# EAGLE design dmx2rgb (EAGLE 6.2)
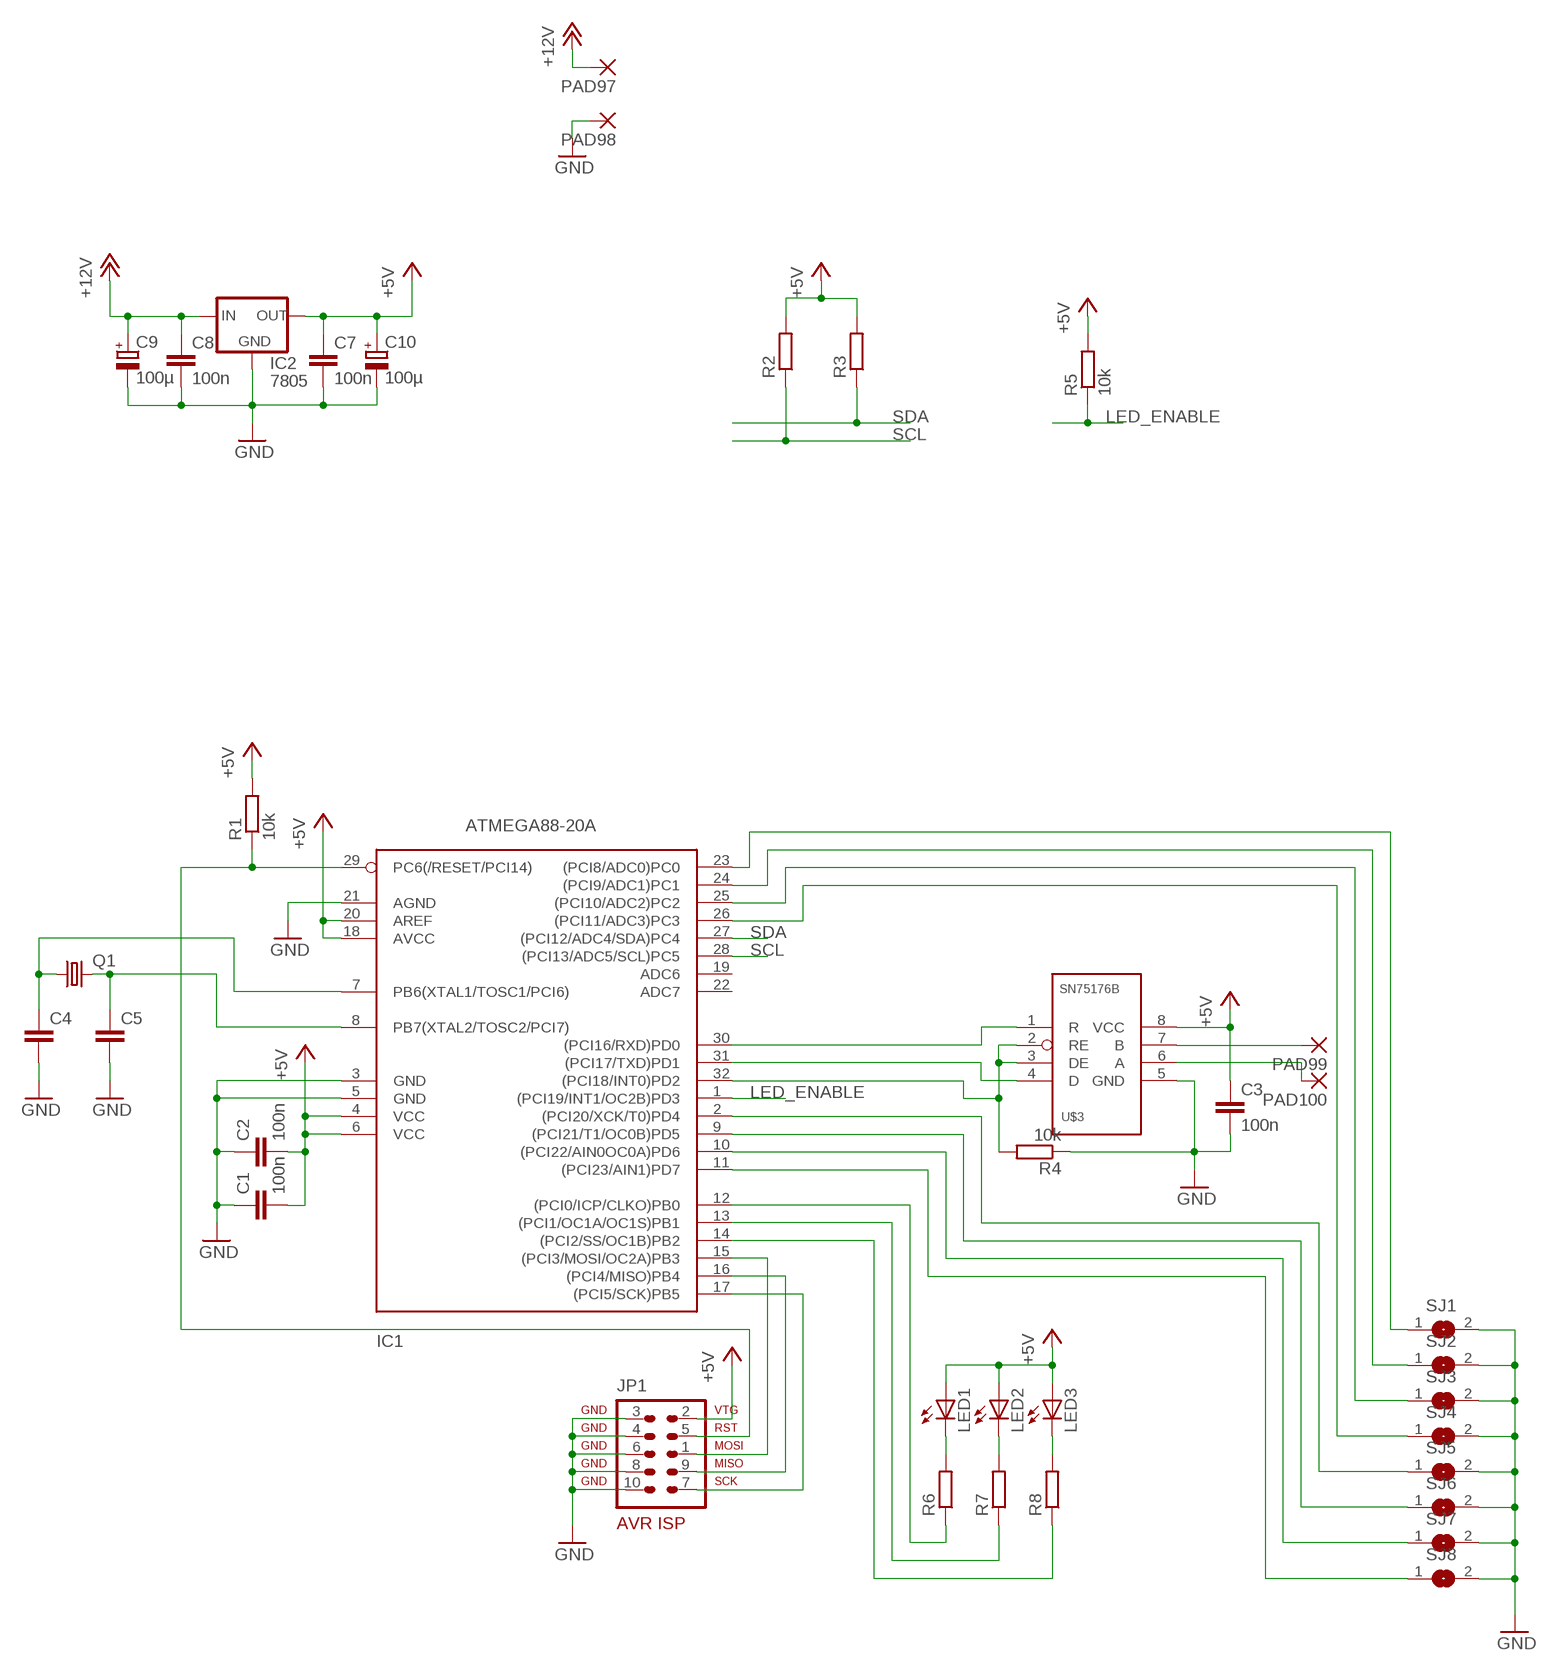
[diagram p0: schematic, sheet 1, part 1 of 2]
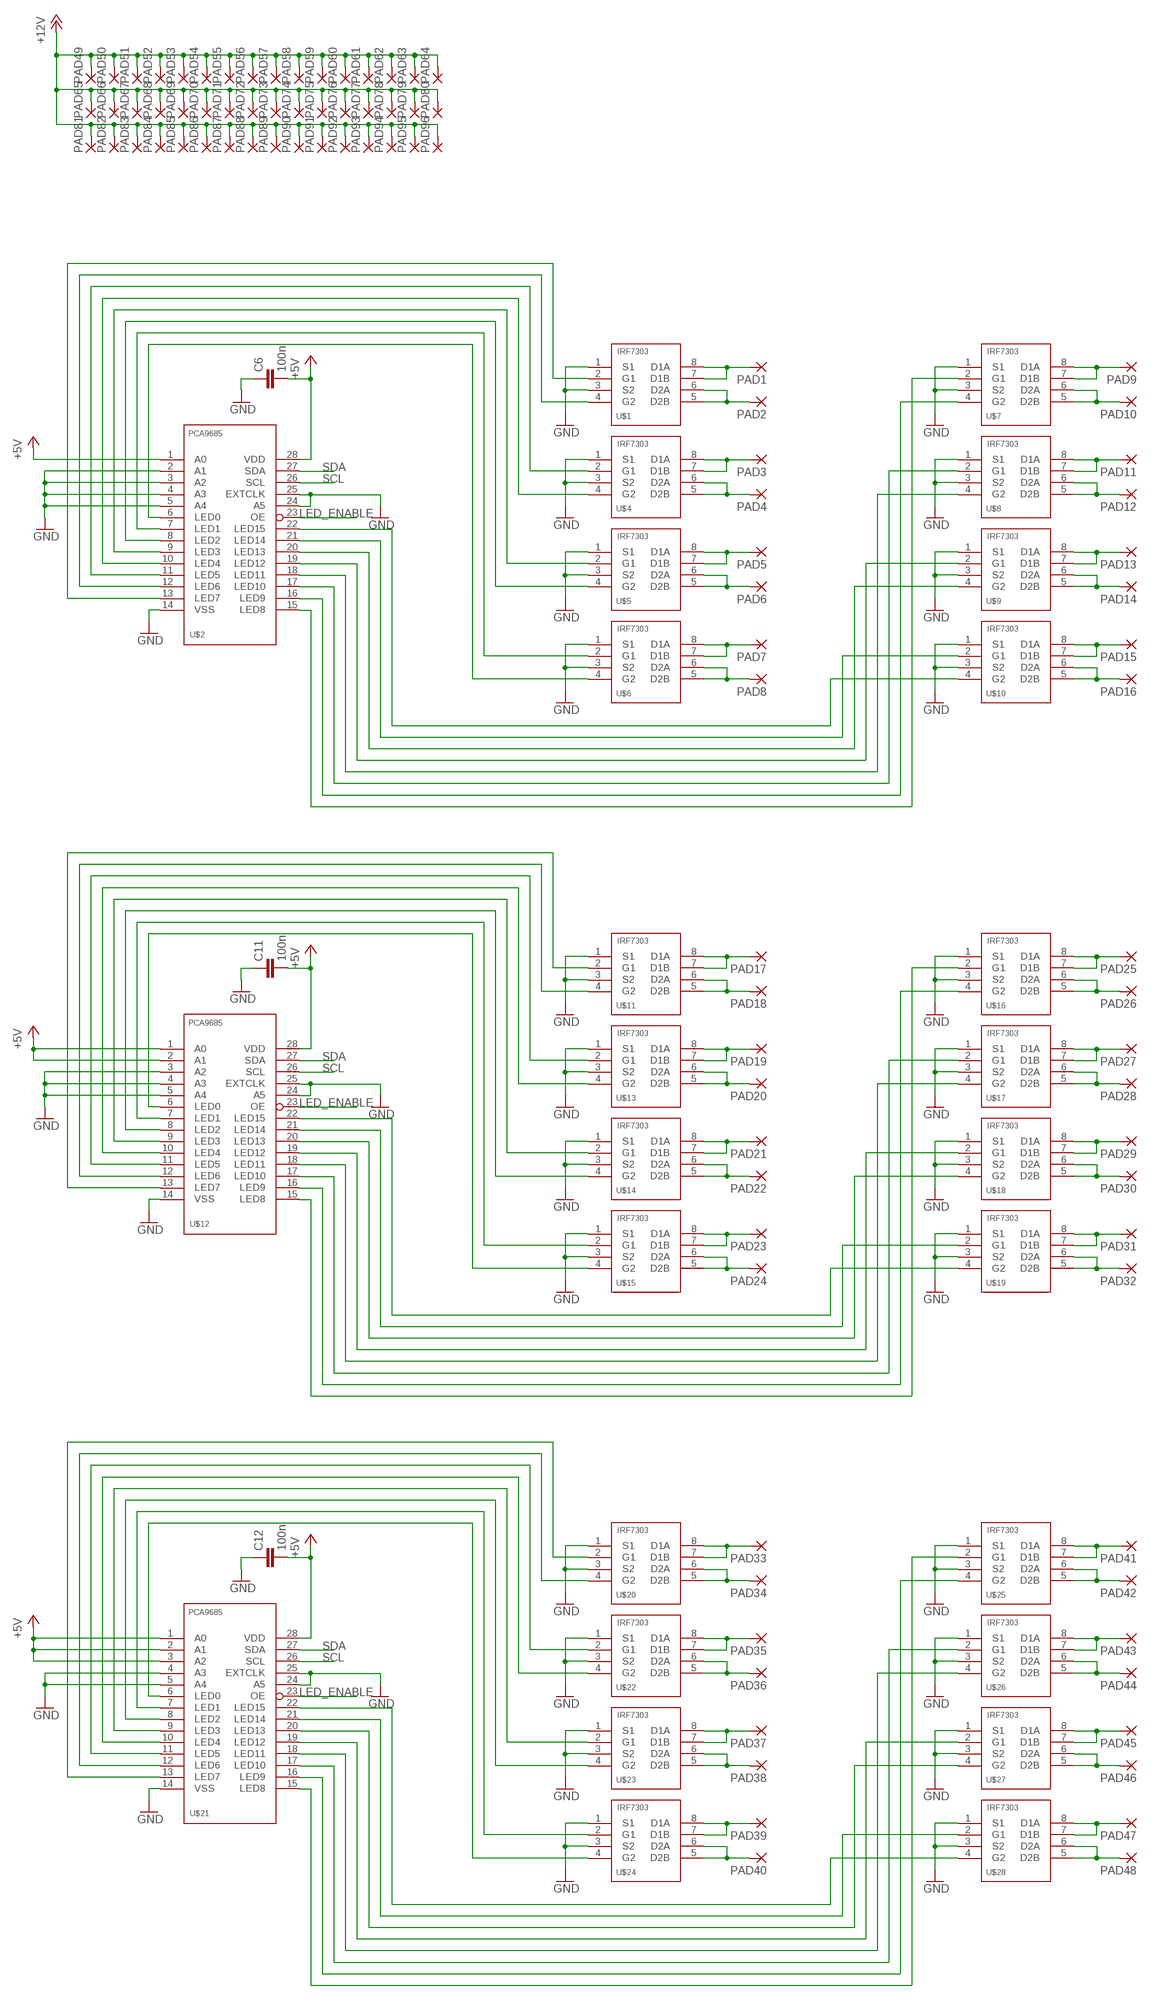
[diagram p1: schematic, sheet 1, part 2 of 2]

## Parts
C1  100n  C0805  [CHIP_0805]
C2  100n  C0805  [CHIP_0805]
C3  100n  C0805  [CHIP_0805]
C4  C0805  [CHIP_0805]
C5  C0805  [CHIP_0805]
C6  100n  C0805  [CHIP_0805]
C7  100n  C0805  [CHIP_0805]
C8  100n  C0805  [CHIP_0805]
C9  100µ  CPOL-EUE2.5-7  [E2,5-7]
C10  100µ  CPOL-EUE2.5-7  [E2,5-7]
C11  100n  C0805  [CHIP_0805]
C12  100n  C0805  [CHIP_0805]
IC1  ATMEGA88-20A  [TQFP32-08]
IC2  7805  78LXX  [78LXX]
JP1  AVR-ISP-10  [AVR-ISP-10]
LED1  LEDCHIPLED_0805  [CHIPLED_0805]
LED2  LEDCHIPLED_0805  [CHIPLED_0805]
LED3  LEDCHIPLED_0805  [CHIPLED_0805]
PAD1  SMD_PAD_LONG  [SMD_PAD_LONG]
PAD2  SMD_PAD_LONG  [SMD_PAD_LONG]
PAD3  SMD_PAD_LONG  [SMD_PAD_LONG]
PAD4  SMD_PAD_LONG  [SMD_PAD_LONG]
PAD5  SMD_PAD_LONG  [SMD_PAD_LONG]
PAD6  SMD_PAD_LONG  [SMD_PAD_LONG]
PAD7  SMD_PAD_LONG  [SMD_PAD_LONG]
PAD8  SMD_PAD_LONG  [SMD_PAD_LONG]
PAD9  SMD_PAD_LONG  [SMD_PAD_LONG]
PAD10  SMD_PAD_LONG  [SMD_PAD_LONG]
PAD11  SMD_PAD_LONG  [SMD_PAD_LONG]
PAD12  SMD_PAD_LONG  [SMD_PAD_LONG]
PAD13  SMD_PAD_LONG  [SMD_PAD_LONG]
PAD14  SMD_PAD_LONG  [SMD_PAD_LONG]
PAD15  SMD_PAD_LONG  [SMD_PAD_LONG]
PAD16  SMD_PAD_LONG  [SMD_PAD_LONG]
PAD17  SMD_PAD_LONG  [SMD_PAD_LONG]
PAD18  SMD_PAD_LONG  [SMD_PAD_LONG]
PAD19  SMD_PAD_LONG  [SMD_PAD_LONG]
PAD20  SMD_PAD_LONG  [SMD_PAD_LONG]
PAD21  SMD_PAD_LONG  [SMD_PAD_LONG]
PAD22  SMD_PAD_LONG  [SMD_PAD_LONG]
PAD23  SMD_PAD_LONG  [SMD_PAD_LONG]
PAD24  SMD_PAD_LONG  [SMD_PAD_LONG]
PAD25  SMD_PAD_LONG  [SMD_PAD_LONG]
PAD26  SMD_PAD_LONG  [SMD_PAD_LONG]
PAD27  SMD_PAD_LONG  [SMD_PAD_LONG]
PAD28  SMD_PAD_LONG  [SMD_PAD_LONG]
PAD29  SMD_PAD_LONG  [SMD_PAD_LONG]
PAD30  SMD_PAD_LONG  [SMD_PAD_LONG]
PAD31  SMD_PAD_LONG  [SMD_PAD_LONG]
PAD32  SMD_PAD_LONG  [SMD_PAD_LONG]
PAD33  SMD_PAD_LONG  [SMD_PAD_LONG]
PAD34  SMD_PAD_LONG  [SMD_PAD_LONG]
PAD35  SMD_PAD_LONG  [SMD_PAD_LONG]
PAD36  SMD_PAD_LONG  [SMD_PAD_LONG]
PAD37  SMD_PAD_LONG  [SMD_PAD_LONG]
PAD38  SMD_PAD_LONG  [SMD_PAD_LONG]
PAD39  SMD_PAD_LONG  [SMD_PAD_LONG]
PAD40  SMD_PAD_LONG  [SMD_PAD_LONG]
PAD41  SMD_PAD_LONG  [SMD_PAD_LONG]
PAD42  SMD_PAD_LONG  [SMD_PAD_LONG]
PAD43  SMD_PAD_LONG  [SMD_PAD_LONG]
PAD44  SMD_PAD_LONG  [SMD_PAD_LONG]
PAD45  SMD_PAD_LONG  [SMD_PAD_LONG]
PAD46  SMD_PAD_LONG  [SMD_PAD_LONG]
PAD47  SMD_PAD_LONG  [SMD_PAD_LONG]
PAD48  SMD_PAD_LONG  [SMD_PAD_LONG]
PAD49  SMD_PAD_LONG  [SMD_PAD_LONG]
PAD50  SMD_PAD_LONG  [SMD_PAD_LONG]
PAD51  SMD_PAD_LONG  [SMD_PAD_LONG]
PAD52  SMD_PAD_LONG  [SMD_PAD_LONG]
PAD53  SMD_PAD_LONG  [SMD_PAD_LONG]
PAD54  SMD_PAD_LONG  [SMD_PAD_LONG]
PAD55  SMD_PAD_LONG  [SMD_PAD_LONG]
PAD56  SMD_PAD_LONG  [SMD_PAD_LONG]
PAD57  SMD_PAD_LONG  [SMD_PAD_LONG]
PAD58  SMD_PAD_LONG  [SMD_PAD_LONG]
PAD59  SMD_PAD_LONG  [SMD_PAD_LONG]
PAD60  SMD_PAD_LONG  [SMD_PAD_LONG]
PAD61  SMD_PAD_LONG  [SMD_PAD_LONG]
PAD62  SMD_PAD_LONG  [SMD_PAD_LONG]
PAD63  SMD_PAD_LONG  [SMD_PAD_LONG]
PAD64  SMD_PAD_LONG  [SMD_PAD_LONG]
PAD65  SMD_PAD_LONG  [SMD_PAD_LONG]
PAD66  SMD_PAD_LONG  [SMD_PAD_LONG]
PAD67  SMD_PAD_LONG  [SMD_PAD_LONG]
PAD68  SMD_PAD_LONG  [SMD_PAD_LONG]
PAD69  SMD_PAD_LONG  [SMD_PAD_LONG]
PAD70  SMD_PAD_LONG  [SMD_PAD_LONG]
PAD71  SMD_PAD_LONG  [SMD_PAD_LONG]
PAD72  SMD_PAD_LONG  [SMD_PAD_LONG]
PAD73  SMD_PAD_LONG  [SMD_PAD_LONG]
PAD74  SMD_PAD_LONG  [SMD_PAD_LONG]
PAD75  SMD_PAD_LONG  [SMD_PAD_LONG]
PAD76  SMD_PAD_LONG  [SMD_PAD_LONG]
PAD77  SMD_PAD_LONG  [SMD_PAD_LONG]
PAD78  SMD_PAD_LONG  [SMD_PAD_LONG]
PAD79  SMD_PAD_LONG  [SMD_PAD_LONG]
PAD80  SMD_PAD_LONG  [SMD_PAD_LONG]
PAD81  SMD_PAD_LONG  [SMD_PAD_LONG]
PAD82  SMD_PAD_LONG  [SMD_PAD_LONG]
PAD83  SMD_PAD_LONG  [SMD_PAD_LONG]
PAD84  SMD_PAD_LONG  [SMD_PAD_LONG]
PAD85  SMD_PAD_LONG  [SMD_PAD_LONG]
PAD86  SMD_PAD_LONG  [SMD_PAD_LONG]
PAD87  SMD_PAD_LONG  [SMD_PAD_LONG]
PAD88  SMD_PAD_LONG  [SMD_PAD_LONG]
PAD89  SMD_PAD_LONG  [SMD_PAD_LONG]
PAD90  SMD_PAD_LONG  [SMD_PAD_LONG]
PAD91  SMD_PAD_LONG  [SMD_PAD_LONG]
PAD92  SMD_PAD_LONG  [SMD_PAD_LONG]
PAD93  SMD_PAD_LONG  [SMD_PAD_LONG]
PAD94  SMD_PAD_LONG  [SMD_PAD_LONG]
PAD95  SMD_PAD_LONG  [SMD_PAD_LONG]
PAD96  SMD_PAD_LONG  [SMD_PAD_LONG]
PAD97  SMD5  [SMD2,54-5,08]
PAD98  SMD5  [SMD2,54-5,08]
PAD99  SMD_PAD_LONG  [SMD_PAD_LONG]
PAD100  SMD_PAD_LONG  [SMD_PAD_LONG]
Q1  CRYSTAL49  [HC49/S]
R1  10k  R0805  [CHIP_0805]
R2  R0805  [CHIP_0805]
R3  R0805  [CHIP_0805]
R4  10k  R0805  [CHIP_0805]
R5  10k  R0805  [CHIP_0805]
R6  R0805  [CHIP_0805]
R7  R0805  [CHIP_0805]
R8  R0805  [CHIP_0805]
SJ1  SJ  [SJ]
SJ2  SJ  [SJ]
SJ3  SJ  [SJ]
SJ4  SJ  [SJ]
SJ5  SJ  [SJ]
SJ6  SJ  [SJ]
SJ7  SJ  [SJ]
SJ8  SJ  [SJ]
U$1  IRF7303  [SO8]
U$2  PCA9685  [TSSOP28]
U$3  SN75176B  [SO8]
U$4  IRF7303  [SO8]
U$5  IRF7303  [SO8]
U$6  IRF7303  [SO8]
U$7  IRF7303  [SO8]
U$8  IRF7303  [SO8]
U$9  IRF7303  [SO8]
U$10  IRF7303  [SO8]
U$11  IRF7303  [SO8]
U$12  PCA9685  [TSSOP28]
U$13  IRF7303  [SO8]
U$14  IRF7303  [SO8]
U$15  IRF7303  [SO8]
U$16  IRF7303  [SO8]
U$17  IRF7303  [SO8]
U$18  IRF7303  [SO8]
U$19  IRF7303  [SO8]
U$20  IRF7303  [SO8]
U$21  PCA9685  [TSSOP28]
U$22  IRF7303  [SO8]
U$23  IRF7303  [SO8]
U$24  IRF7303  [SO8]
U$25  IRF7303  [SO8]
U$26  IRF7303  [SO8]
U$27  IRF7303  [SO8]
U$28  IRF7303  [SO8]

## Nets
+5V: C1.2 C2.2 C3.1 C6.2 C7.1 C10.+ C11.2 C12.2 IC1.4(VCC) IC1.6(VCC) IC1.18(AVCC) IC1.20(AREF) IC2.OUT JP1.2 LED1.A LED2.A LED3.A R1.2 R2.2 R3.2 R5.2 U$2.1(A0) U$2.28(VDD) U$3.8(VCC) U$12.1(A0) U$12.2(A1) U$12.28(VDD) U$21.1(A0) U$21.2(A1) U$21.3(A2) U$21.28(VDD)
+12V: C8.1 C9.+ IC2.IN PAD49.P$1(P) PAD50.P$1(P) PAD51.P$1(P) PAD52.P$1(P) PAD53.P$1(P) PAD54.P$1(P) PAD55.P$1(P) PAD56.P$1(P) PAD57.P$1(P) PAD58.P$1(P) PAD59.P$1(P) PAD60.P$1(P) PAD61.P$1(P) PAD62.P$1(P) PAD63.P$1(P) PAD64.P$1(P) PAD65.P$1(P) PAD66.P$1(P) PAD67.P$1(P) PAD68.P$1(P) PAD69.P$1(P) PAD70.P$1(P) PAD71.P$1(P) PAD72.P$1(P) PAD73.P$1(P) PAD74.P$1(P) PAD75.P$1(P) PAD76.P$1(P) PAD77.P$1(P) PAD78.P$1(P) PAD79.P$1(P) PAD80.P$1(P) PAD81.P$1(P) PAD82.P$1(P) PAD83.P$1(P) PAD84.P$1(P) PAD85.P$1(P) PAD86.P$1(P) PAD87.P$1(P) PAD88.P$1(P) PAD89.P$1(P) PAD90.P$1(P) PAD91.P$1(P) PAD92.P$1(P) PAD93.P$1(P) PAD94.P$1(P) PAD95.P$1(P) PAD96.P$1(P) PAD97.1(P)
GND: C1.1 C2.1 C3.2 C4.2 C5.2 C6.1 C7.2 C8.2 C9.- C10.- C11.1 C12.1 IC1.3(GND) IC1.5(GND) IC1.21(AGND) IC2.GND JP1.3 JP1.4 JP1.6 JP1.8 JP1.10 PAD98.1(P) R4.1 SJ1.2 SJ2.2 SJ3.2 SJ4.2 SJ5.2 SJ6.2 SJ7.2 SJ8.2 U$1.1(S1) U$1.3(S2) U$2.2(A1) U$2.3(A2) U$2.4(A3) U$2.5(A4) U$2.14(VSS) U$2.24(A5) U$2.25(EXTCLK) U$3.5(GND) U$4.1(S1) U$4.3(S2) U$5.1(S1) U$5.3(S2) U$6.1(S1) U$6.3(S2) U$7.1(S1) U$7.3(S2) U$8.1(S1) U$8.3(S2) U$9.1(S1) U$9.3(S2) U$10.1(S1) U$10.3(S2) U$11.1(S1) U$11.3(S2) U$12.3(A2) U$12.4(A3) U$12.5(A4) U$12.14(VSS) U$12.24(A5) U$12.25(EXTCLK) U$13.1(S1) U$13.3(S2) U$14.1(S1) U$14.3(S2) U$15.1(S1) U$15.3(S2) U$16.1(S1) U$16.3(S2) U$17.1(S1) U$17.3(S2) U$18.1(S1) U$18.3(S2) U$19.1(S1) U$19.3(S2) U$20.1(S1) U$20.3(S2) U$21.4(A3) U$21.5(A4) U$21.14(VSS) U$21.24(A5) U$21.25(EXTCLK) U$22.1(S1) U$22.3(S2) U$23.1(S1) U$23.3(S2) U$24.1(S1) U$24.3(S2) U$25.1(S1) U$25.3(S2) U$26.1(S1) U$26.3(S2) U$27.1(S1) U$27.3(S2) U$28.1(S1) U$28.3(S2)
LED_ENABLE: IC1.1((PCI19/INT1/OC2B)PD3) R5.1 U$2.23(OE) U$12.23(OE) U$21.23(OE)
N$1: IC1.30((PCI16/RXD)PD0) U$3.1(R)
N$2: IC1.31((PCI17/TXD)PD1) U$3.4(D)
N$3: LED3.C R8.2
N$4: IC1.32((PCI18/INT0)PD2) R4.2 U$3.2(RE) U$3.3(DE)
N$5: PAD1.P$1(P) U$1.7(D1B) U$1.8(D1A)
N$6: PAD2.P$1(P) U$1.5(D2B) U$1.6(D2A)
N$7: IC1.29(PC6(/RESET/PCI14)) JP1.5 R1.1
N$8: IC1.15((PCI3/MOSI/OC2A)PB3) JP1.1
N$9: IC1.16((PCI4/MISO)PB4) JP1.9
N$10: IC1.17((PCI5/SCK)PB5) JP1.7
N$11: PAD99.P$1(P) U$3.7(B)
N$13: PAD3.P$1(P) U$4.7(D1B) U$4.8(D1A)
N$14: PAD4.P$1(P) U$4.5(D2B) U$4.6(D2A)
N$15: LED2.C R7.2
N$16: U$2.10(LED4) U$4.4(G2)
N$17: PAD5.P$1(P) U$5.7(D1B) U$5.8(D1A)
N$18: PAD6.P$1(P) U$5.5(D2B) U$5.6(D2A)
N$19: U$2.9(LED3) U$5.2(G1)
N$20: U$2.8(LED2) U$5.4(G2)
N$21: PAD7.P$1(P) U$6.7(D1B) U$6.8(D1A)
N$22: PAD8.P$1(P) U$6.5(D2B) U$6.6(D2A)
N$23: U$2.7(LED1) U$6.2(G1)
N$24: U$2.6(LED0) U$6.4(G2)
N$25: PAD9.P$1(P) U$7.7(D1B) U$7.8(D1A)
N$26: PAD10.P$1(P) U$7.5(D2B) U$7.6(D2A)
N$27: LED1.C R6.2
N$28: IC1.12((PCI0/ICP/CLKO)PB0) R6.1
N$29: PAD11.P$1(P) U$8.7(D1B) U$8.8(D1A)
N$30: PAD12.P$1(P) U$8.5(D2B) U$8.6(D2A)
N$31: IC1.13((PCI1/OC1A/OC1S)PB1) R7.1
N$32: IC1.14((PCI2/SS/OC1B)PB2) R8.1
N$33: PAD13.P$1(P) U$9.7(D1B) U$9.8(D1A)
N$34: PAD14.P$1(P) U$9.5(D2B) U$9.6(D2A)
N$35: IC1.26((PCI11/ADC3)PC3) SJ4.1
N$36: IC1.25((PCI10/ADC2)PC2) SJ3.1
N$37: PAD15.P$1(P) U$10.7(D1B) U$10.8(D1A)
N$38: PAD16.P$1(P) U$10.5(D2B) U$10.6(D2A)
N$39: IC1.24((PCI9/ADC1)PC1) SJ2.1
N$40: IC1.23((PCI8/ADC0)PC0) SJ1.1
N$41: C4.1 IC1.7(PB6(XTAL1/TOSC1/PCI6)) Q1.1
N$42: C5.1 IC1.8(PB7(XTAL2/TOSC2/PCI7)) Q1.2
N$43: IC1.2((PCI20/XCK/T0)PD4) SJ5.1
N$44: IC1.9((PCI21/T1/OC0B)PD5) SJ6.1
N$45: IC1.10((PCI22/AIN0OC0A)PD6) SJ7.1
N$46: IC1.11((PCI23/AIN1)PD7) SJ8.1
N$47: PAD100.P$1(P) U$3.6(A)
N$48: PAD17.P$1(P) U$11.7(D1B) U$11.8(D1A)
N$49: PAD18.P$1(P) U$11.5(D2B) U$11.6(D2A)
N$50: U$1.2(G1) U$2.13(LED7)
N$51: U$1.4(G2) U$2.12(LED6)
N$52: U$2.11(LED5) U$4.2(G1)
N$53: U$2.15(LED8) U$7.2(G1)
N$54: U$2.16(LED9) U$7.4(G2)
N$55: U$2.17(LED10) U$8.2(G1)
N$56: U$2.18(LED11) U$8.4(G2)
N$57: U$2.19(LED12) U$9.2(G1)
N$58: U$2.20(LED13) U$9.4(G2)
N$59: U$2.21(LED14) U$10.2(G1)
N$60: U$2.22(LED15) U$10.4(G2)
N$61: PAD19.P$1(P) U$13.7(D1B) U$13.8(D1A)
N$63: PAD20.P$1(P) U$13.5(D2B) U$13.6(D2A)
N$64: U$12.10(LED4) U$13.4(G2)
N$65: PAD21.P$1(P) U$14.7(D1B) U$14.8(D1A)
N$66: PAD22.P$1(P) U$14.5(D2B) U$14.6(D2A)
N$67: U$12.9(LED3) U$14.2(G1)
N$68: U$12.8(LED2) U$14.4(G2)
N$69: PAD23.P$1(P) U$15.7(D1B) U$15.8(D1A)
N$70: PAD24.P$1(P) U$15.5(D2B) U$15.6(D2A)
N$71: U$12.7(LED1) U$15.2(G1)
N$72: U$12.6(LED0) U$15.4(G2)
N$73: PAD25.P$1(P) U$16.7(D1B) U$16.8(D1A)
N$74: PAD26.P$1(P) U$16.5(D2B) U$16.6(D2A)
N$75: PAD27.P$1(P) U$17.7(D1B) U$17.8(D1A)
N$76: PAD28.P$1(P) U$17.5(D2B) U$17.6(D2A)
N$77: PAD29.P$1(P) U$18.7(D1B) U$18.8(D1A)
N$78: PAD30.P$1(P) U$18.5(D2B) U$18.6(D2A)
N$79: PAD31.P$1(P) U$19.7(D1B) U$19.8(D1A)
N$80: PAD32.P$1(P) U$19.5(D2B) U$19.6(D2A)
N$81: U$11.2(G1) U$12.13(LED7)
N$82: U$11.4(G2) U$12.12(LED6)
N$83: U$12.11(LED5) U$13.2(G1)
N$84: U$12.15(LED8) U$16.2(G1)
N$85: U$12.16(LED9) U$16.4(G2)
N$86: U$12.17(LED10) U$17.2(G1)
N$87: U$12.18(LED11) U$17.4(G2)
N$88: U$12.19(LED12) U$18.2(G1)
N$89: U$12.20(LED13) U$18.4(G2)
N$90: U$12.21(LED14) U$19.2(G1)
N$91: U$12.22(LED15) U$19.4(G2)
N$98: PAD33.P$1(P) U$20.7(D1B) U$20.8(D1A)
N$99: PAD34.P$1(P) U$20.5(D2B) U$20.6(D2A)
N$100: PAD35.P$1(P) U$22.7(D1B) U$22.8(D1A)
N$101: PAD36.P$1(P) U$22.5(D2B) U$22.6(D2A)
N$102: U$21.10(LED4) U$22.4(G2)
N$103: PAD37.P$1(P) U$23.7(D1B) U$23.8(D1A)
N$104: PAD38.P$1(P) U$23.5(D2B) U$23.6(D2A)
N$105: U$21.9(LED3) U$23.2(G1)
N$106: U$21.8(LED2) U$23.4(G2)
N$107: PAD39.P$1(P) U$24.7(D1B) U$24.8(D1A)
N$108: PAD40.P$1(P) U$24.5(D2B) U$24.6(D2A)
N$109: U$21.7(LED1) U$24.2(G1)
N$110: U$21.6(LED0) U$24.4(G2)
N$111: PAD41.P$1(P) U$25.7(D1B) U$25.8(D1A)
N$112: PAD42.P$1(P) U$25.5(D2B) U$25.6(D2A)
N$113: PAD43.P$1(P) U$26.7(D1B) U$26.8(D1A)
N$114: PAD44.P$1(P) U$26.5(D2B) U$26.6(D2A)
N$115: PAD45.P$1(P) U$27.7(D1B) U$27.8(D1A)
N$116: PAD46.P$1(P) U$27.5(D2B) U$27.6(D2A)
N$117: PAD47.P$1(P) U$28.7(D1B) U$28.8(D1A)
N$118: PAD48.P$1(P) U$28.5(D2B) U$28.6(D2A)
N$119: U$20.2(G1) U$21.13(LED7)
N$120: U$20.4(G2) U$21.12(LED6)
N$121: U$21.11(LED5) U$22.2(G1)
N$122: U$21.15(LED8) U$25.2(G1)
N$123: U$21.16(LED9) U$25.4(G2)
N$124: U$21.17(LED10) U$26.2(G1)
N$125: U$21.18(LED11) U$26.4(G2)
N$126: U$21.19(LED12) U$27.2(G1)
N$127: U$21.20(LED13) U$27.4(G2)
N$128: U$21.21(LED14) U$28.2(G1)
N$129: U$21.22(LED15) U$28.4(G2)
SCL: IC1.28((PCI13/ADC5/SCL)PC5) R2.1 U$2.26(SCL) U$12.26(SCL) U$21.26(SCL)
SDA: IC1.27((PCI12/ADC4/SDA)PC4) R3.1 U$2.27(SDA) U$12.27(SDA) U$21.27(SDA)
Unconnected: IC1.19(ADC6) IC1.22(ADC7)

## Library data of the parts
C1-C8 C11 C12 = dmx2rgb:C
C9 C10 = dmx2rgb:CPOL-EU: POLARIZED CAPACITOR, European symbol
IC1 = dmx2rgb:ATMEGA88: MICROCONTROLLER 8 kBytes FLASH 1 kBytes SRAM 512 Bytes EEPROM USART 8-channel 10 bit ADC
IC2 = dmx2rgb:78LXX: VOLTAGE REGULATOR
JP1 = dmx2rgb:AVR-ISP-10: AVR ISP-10 Serial Programming Header
LED1-LED3 = dmx2rgb:LED: LED OSRAM: - CHIPLED LG R971, LG N971, LY N971, LG Q971, LY Q971, LO R971, LY R971 LH N974, LH R974 LS Q976, LO Q976, LY Q976 LO Q996 - Hyper CHIPLED LW Q18S LB Q993, LB Q99A, LB R99A - SideLED LS A670, LO A670, LY A670, LG A670, LP A670 LB A673, LV A673, LT A673, LW A673 LH A674 LY A675 LS A676, LA A676, LO A676, LY A676, LW A676 LS A679, LY A679, LG A679 - Hyper Micro SIDELED® LS Y876, LA Y876, LO Y876, LY Y876 LT Y87S - SmartLED LW L88C, LW L88S LB L89C, LB L89S, LG L890 LS L89K, LO L89K, LY L89K LS L896, LA L896, LO L896, LY L896 - TOPLED LS T670, LO T670, LY T670, LG T670, LP T670 LSG T670, LSP T670, LSY T670, LOP T670, LYG T670 LG T671, LOG T671, LSG T671 LB T673, LV T673, LT T673, LW T673 LH T674 LS T676, LA T676, LO T676, LY T676, LB T676, LH T676, LSB T676, LW T676 LB T67C, LV T67C, LT T67C, LS T67K, LO T67K, LY T67K, LW E67C LS E67B, LA E67B, LO E67B, LY E67B, LB E67C, LV E67C, LT E67C LW T67C LS T679, LY T679, LG T679 LS T770, LO T770, LY T770, LG T770, LP T770 LB T773, LV T773, LT T773, LW T773 LH T774 LS E675, LA E675, LY E675, LS T675 LS T776, LA T776, LO T776, LY T776, LB T776 LHGB T686 LT T68C, LB T68C - Hyper Mini TOPLED® LB M676 - Mini TOPLED Santana® LG M470 LS M47K, LO M47K, LY M47K Source: http://www.osram.convergy.de/
PAD1-PAD96 PAD99 PAD100 = dmx2rgb:SMD_PAD_LONG
PAD97 PAD98 = dmx2rgb:SMD5: SMD PAD
Q1 = dmx2rgb:CRYSTAL49
R1-R8 = dmx2rgb:R
SJ1-SJ8 = dmx2rgb:SJ: SMD solder JUMPER
U$1 U$4-U$11 U$13-U$20 U$22-U$28 = dmx2rgb:IRF7303
U$2 U$12 U$21 = dmx2rgb:PCA9685
U$3 = dmx2rgb:SN75176B

## Board
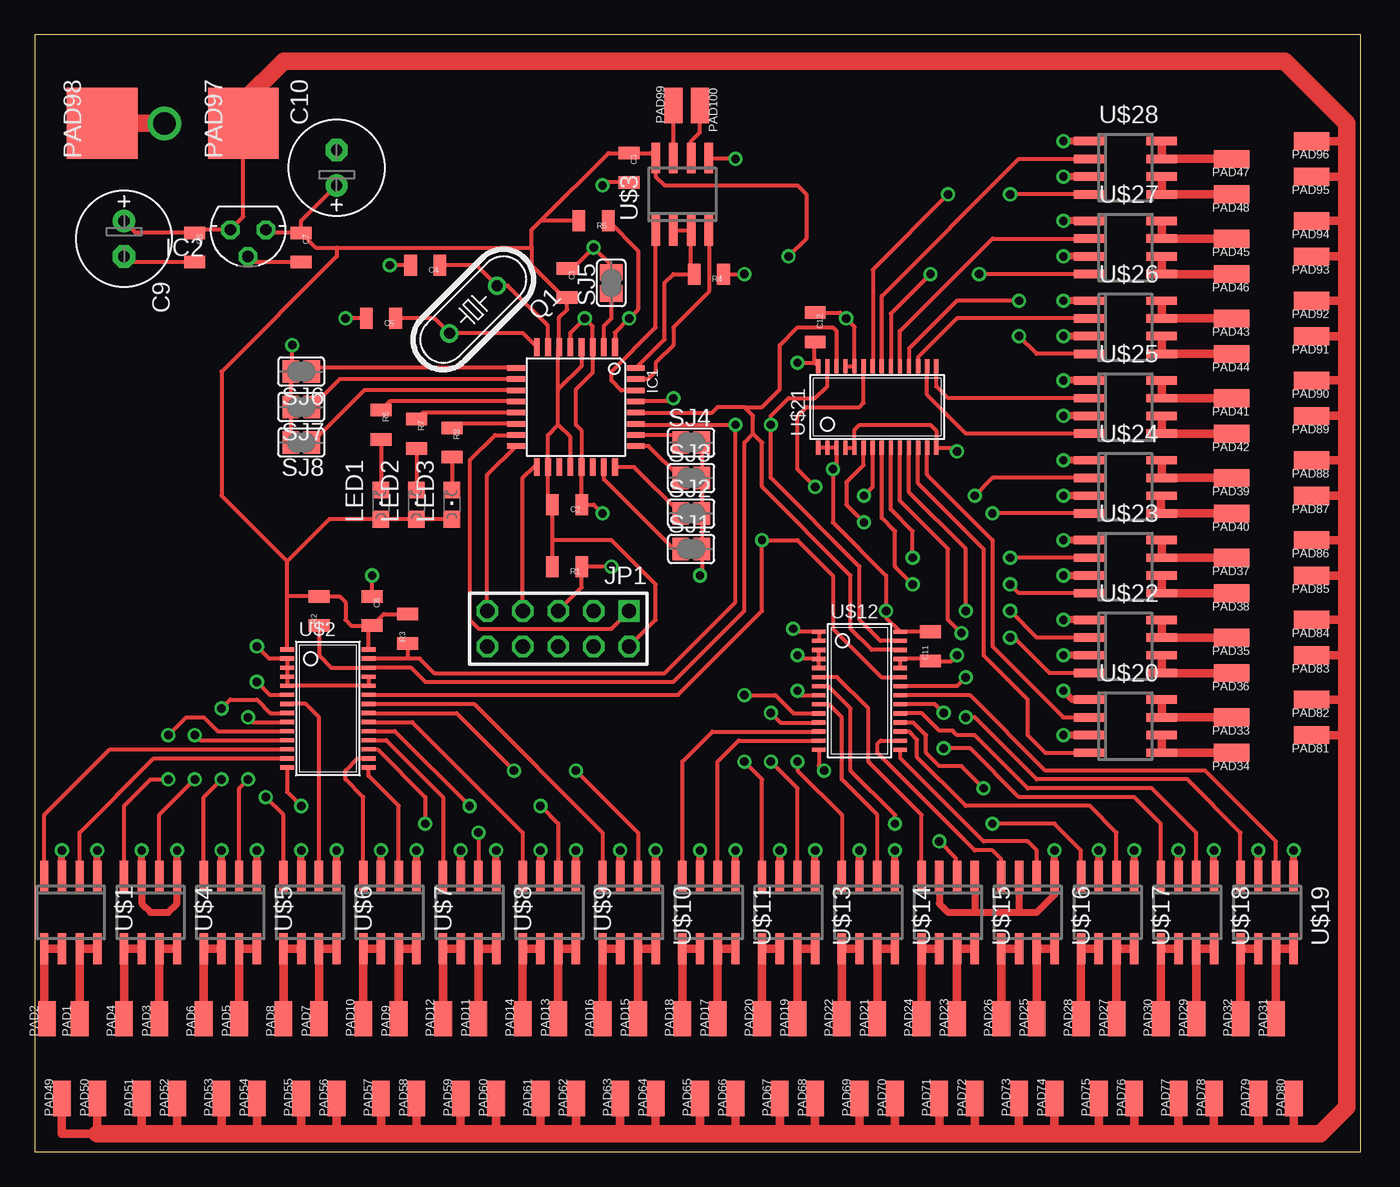
[diagram p2: board, top side]
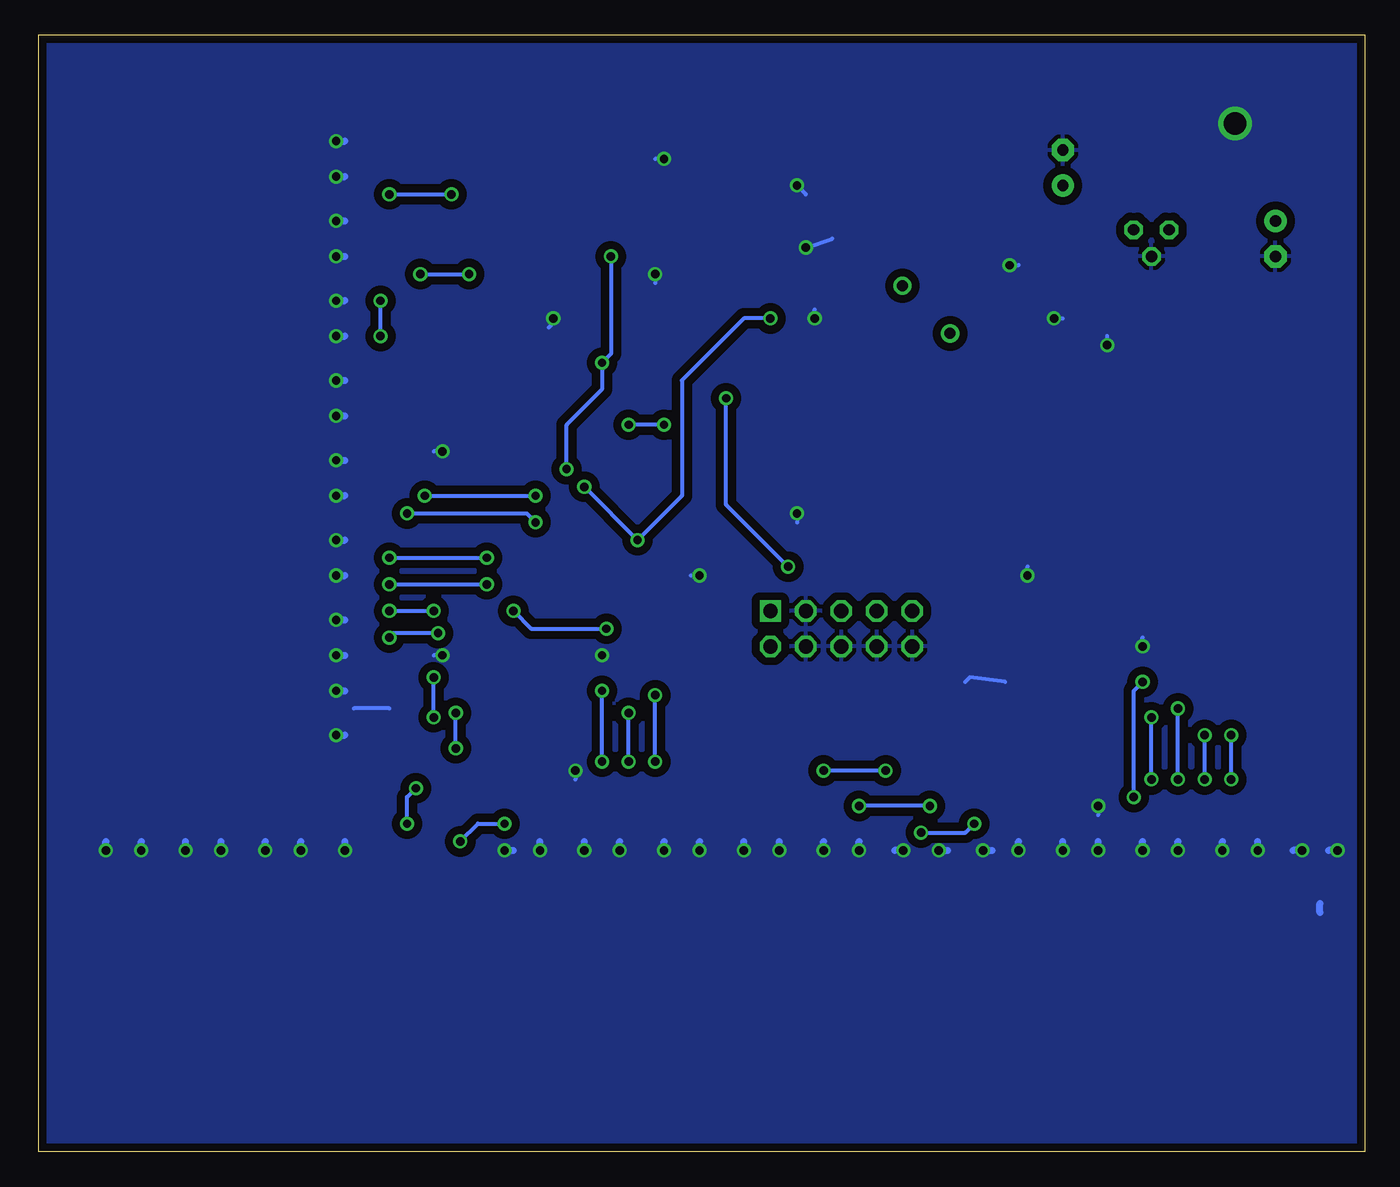
[diagram p3: board, bottom side, seen from below]

Size 95 x 80 mm. Coordinates in mm from the lower left corner, seen from the top.
Outline: 0,0 95,0 95,80 0,80 0,0
Copper layers (1*16): Top 0.035mm / dielectric 1.5mm / Bottom 0.035mm
Design rules: minimum track width 0.3mm, minimum drill 0.3mm, track to track 0.3mm, track to pad 0.3mm, pad to pad 0.3mm, via to via 0.3mm, smd to smd 0.2mm, copper to edge 0.2mm, drill to drill 1mm, minimum pad ring 10mil, minimum via ring 8mil, stop-mask expansion 4mil, vias tented up to drill 0mil, thermal gap 0.3mm

### Footprints (pad centres in the part's own frame; a part is rotated, then mirrored left to right if it is on the bottom)
CHIP_0805 = smd 0.9 x 1.5: 1 -1.05,0; 2 1.05,0
E2,5-7 = drill 0.813 pad 1.6: + -1.27,0 | drill 0.813 pad 1.6 octagon: - 1.27,0
TQFP32-08 = smd 1.27 x 0.4: 1 -4.293,2.8; 2 -4.293,2; 3 -4.293,1.2; 4 -4.293,0.4; 5 -4.293,-0.4; 6 -4.293,-1.2; 7 -4.293,-2; 8 -4.293,-2.8; 17 4.293,-2.8; 18 4.293,-2; 19 4.293,-1.2; 20 4.293,-0.4; 21 4.293,0.4; 22 4.293,1.2; 23 4.293,2; 24 4.293,2.8 | smd 0.4 x 1.27: 9 -2.8,-4.293; 10 -2,-4.293; 11 -1.2,-4.293; 12 -0.4,-4.293; 13 0.4,-4.293; 14 1.2,-4.293; 15 2,-4.293; 16 2.8,-4.293; 25 2.8,4.293; 26 2,4.293; 27 1.2,4.293; 28 0.4,4.293; 29 -0.4,4.293; 30 -1.2,4.293; 31 -2,4.293; 32 -2.8,4.293
78LXX = drill 0.813 octagon: GND 0,1.905; IN 1.27,0; OUT -1.27,0
AVR-ISP-10 = drill 1.016 square: 1 -5.08,-1.27 | drill 1.016 octagon: 2 -5.08,1.27; 3 -2.54,-1.27; 4 -2.54,1.27; 5 0,-1.27; 6 0,1.27; 7 2.54,-1.27; 8 2.54,1.27; 9 5.08,-1.27; 10 5.08,1.27
CHIPLED_0805 = smd 1.2 x 1.2: A 0,-1.05; C 0,1.05
SMD_PAD_LONG = smd 1.27 x 2.54: P$1 0,0
SMD2,54-5,08 = smd 5.08 x 5.08: 1 0,0
HC49/S = drill 0.8 pad 1.1: 1 -2.413,0; 2 2.413,0
SJ = smd 1.168 x 1.6: 1 -0.762,0; 2 0.762,0
SO8 = smd 0.6 x 2.2: 1 -1.905,-2.6; 2 -0.635,-2.6; 3 0.635,-2.6; 4 1.905,-2.6; 5 1.905,2.6; 6 0.635,2.6; 7 -0.635,2.6; 8 -1.905,2.6
TSSOP28 = smd 0.305 x 0.991: 1 -4.225,-2.918; 2 -3.575,-2.918; 3 -2.925,-2.918; 4 -2.275,-2.918; 5 -1.625,-2.918; 6 -0.975,-2.918; 7 -0.325,-2.918; 8 0.325,-2.918; 9 0.975,-2.918; 10 1.625,-2.918; 11 2.275,-2.918; 12 2.925,-2.918; 13 3.575,-2.918; 14 4.225,-2.918; 15 4.225,2.918; 16 3.575,2.918; 17 2.925,2.918; 18 2.275,2.918; 19 1.625,2.918; 20 0.975,2.918; 21 0.325,2.918; 22 -0.325,2.918; 23 -0.975,2.918; 24 -1.625,2.918; 25 -2.275,2.918; 26 -2.925,2.918; 27 -3.575,2.918; 28 -4.225,2.918

### Placement (x,y rotation side)
C1  38.13,62.23 270 top
C2  38.13,46.35 180 top
C3  42.58,70.48 270 top
C4  27.98,63.5 180 top
C5  24.8,59.69 180 top
C6  24.16,38.73 270 top
C7  19.09,64.77 270 top
C8  11.46,64.77 270 top
C9  6.38,65.41 270 top
C10  21.62,70.48 90 top
C11  64.17,36.2 90 top
C12  55.91,59.05 270 top
IC1  38.77,53.34 270 top
IC2  15.28,66.04 180 top
JP1  37.5,37.47 180 top
LED1  24.8,46.35 0 top
LED2  27.34,46.35 0 top
LED3  29.88,46.35 0 top
PAD1  3.21,9.53 0 top
PAD2  0.87,9.53 0 top
PAD3  8.93,9.53 0 top
PAD4  6.38,9.53 0 top
PAD5  14.64,9.53 0 top
PAD6  12.1,9.53 0 top
PAD7  20.36,9.53 0 top
PAD8  17.82,9.53 0 top
PAD9  26.07,9.53 0 top
PAD10  23.53,9.53 0 top
PAD11  31.79,9.53 0 top
PAD12  29.25,9.53 0 top
PAD13  37.5,9.53 0 top
PAD14  34.96,9.53 0 top
PAD15  43.22,9.53 0 top
PAD16  40.67,9.53 0 top
PAD17  48.93,9.53 0 top
PAD18  46.39,9.53 0 top
PAD19  54.65,9.53 0 top
PAD20  52.1,9.53 0 top
PAD21  60.36,9.53 0 top
PAD22  57.82,9.53 0 top
PAD23  66.08,9.53 0 top
PAD24  63.53,9.53 0 top
PAD25  71.79,9.53 0 top
PAD26  69.25,9.53 0 top
PAD27  77.5,9.53 0 top
PAD28  74.97,9.53 0 top
PAD29  83.22,9.53 0 top
PAD30  80.68,9.53 0 top
PAD31  88.94,9.53 0 top
PAD32  86.39,9.53 0 top
PAD33  85.76,31.11 90 top
PAD34  85.76,28.57 90 top
PAD35  85.76,36.83 90 top
PAD36  85.76,34.29 90 top
PAD37  85.76,42.55 90 top
PAD38  85.76,40.01 90 top
PAD39  85.76,48.26 90 top
PAD40  85.76,45.72 90 top
PAD41  85.76,53.98 90 top
PAD42  85.76,51.44 90 top
PAD43  85.76,59.69 90 top
PAD44  85.76,57.15 90 top
PAD45  85.76,65.41 90 top
PAD46  85.76,62.87 90 top
PAD47  85.76,71.12 90 top
PAD48  85.76,68.58 90 top
PAD49  1.94,3.81 0 top
PAD50  4.48,3.81 0 top
PAD51  7.66,3.81 0 top
PAD52  10.2,3.81 0 top
PAD53  13.37,3.81 0 top
PAD54  15.91,3.81 0 top
PAD55  19.09,3.81 0 top
PAD56  21.62,3.81 0 top
PAD57  24.8,3.81 0 top
PAD58  27.34,3.81 0 top
PAD59  30.52,3.81 0 top
PAD60  33.05,3.81 0 top
PAD61  36.23,3.81 0 top
PAD62  38.77,3.81 0 top
PAD63  41.95,3.81 0 top
PAD64  44.48,3.81 0 top
PAD65  47.66,3.81 0 top
PAD66  50.2,3.81 0 top
PAD67  53.38,3.81 0 top
PAD68  55.91,3.81 0 top
PAD69  59.09,3.81 0 top
PAD70  61.63,3.81 0 top
PAD71  64.81,3.81 0 top
PAD72  67.34,3.81 0 top
PAD73  70.52,3.81 0 top
PAD74  73.06,3.81 0 top
PAD75  76.23,3.81 0 top
PAD76  78.78,3.81 0 top
PAD77  81.95,3.81 0 top
PAD78  84.49,3.81 0 top
PAD79  87.67,3.81 0 top
PAD80  90.2,3.81 0 top
PAD81  91.47,29.84 90 top
PAD82  91.47,32.38 90 top
PAD83  91.47,35.56 90 top
PAD84  91.47,38.1 90 top
PAD85  91.47,41.27 90 top
PAD86  91.47,43.81 90 top
PAD87  91.47,46.99 90 top
PAD88  91.47,49.53 90 top
PAD89  91.47,52.7 90 top
PAD90  91.47,55.24 90 top
PAD91  91.47,58.42 90 top
PAD92  91.47,60.96 90 top
PAD93  91.47,64.14 90 top
PAD94  91.47,66.67 90 top
PAD95  91.47,69.85 90 top
PAD96  91.47,72.39 90 top
PAD97  14.94,73.66 0 top
PAD98  4.83,73.66 0 top
PAD99  45.76,74.93 0 top
PAD100  47.66,74.93 180 top
Q1  31.41,60.33 225 top
R1  38.13,41.91 180 top
R2  20.36,38.73 90 top
R3  26.7,37.47 90 top
R4  48.3,62.87 180 top
R5  40.04,66.67 180 top
R6  24.8,52.07 270 top
R7  27.34,51.44 270 top
R8  29.88,50.8 270 top
SJ1  47.02,43.18 0 top
SJ2  47.02,45.72 0 top
SJ3  47.02,48.26 0 top
SJ4  47.02,50.8 0 top
SJ5  41.31,62.23 90 top
SJ6  19.09,55.88 180 top
SJ7  19.09,53.34 180 top
SJ8  19.09,50.8 180 top
U$1  2.58,17.14 180 top
U$2  20.99,31.75 270 top
U$3  46.39,68.58 0 top
U$4  8.29,17.14 180 top
U$5  14.01,17.14 180 top
U$6  19.72,17.14 180 top
U$7  25.43,17.14 180 top
U$8  31.15,17.14 180 top
U$9  36.87,17.14 180 top
U$10  42.58,17.14 180 top
U$11  48.3,17.14 180 top
U$12  59.09,33.02 270 top
U$13  54.01,17.14 180 top
U$14  59.73,17.14 180 top
U$15  65.44,17.14 180 top
U$16  71.16,17.14 180 top
U$17  76.87,17.14 180 top
U$18  82.58,17.14 180 top
U$19  88.3,17.14 180 top
U$20  78.14,30.48 270 top
U$21  60.36,53.34 0 top
U$22  78.14,36.2 270 top
U$23  78.14,41.91 270 top
U$24  78.14,47.62 270 top
U$25  78.14,53.34 270 top
U$26  78.14,59.05 270 top
U$27  78.14,64.77 270 top
U$28  78.14,70.48 270 top

### Tracks (layer width: path | path; a pad name or v marks a point on that pad's centre or on a via)
+5V  (via drill 0.6)
  Top 0.3: C11.2 U$12.28 60.99,38.26 v60.99,38.73 60.99,41.27 57.19,45.09 v57.19,48.9 57.44,49.15 U$21.3 U$21.2 U$21.1 | U$12.2 U$12.1 54.55,37.24 v54.33,37.47 54.42,37.56 | R1.2 37.09,43.81 | 37.09,43.81 C2.2 36.77,46.67 IC1.18 36.77,51.34 37.5,52.07 | 37.5,54.61 37.5,57.56 IC1.6 37.57,59.76 38.13,60.33 C1.2 37.91,61.18 35.59,63.5 35.59,64.77 | IC1.4 39.17,56.28 37.5,54.61 | IC1.20 38.37,51.2 37.5,52.07 | 37.5,52.07 37.5,54.61 | LED3.A LED2.A 27.34,45.09 27.12,45.3 LED1.A 21.09,45.3 18.07,42.29 | JP1.2 44.48,38.1 44.48,40.64 41.31,43.81 37.09,43.81 | 21.62,64.77 20.14,64.77 C7.1 | 21.62,64.77 35.59,64.77 | 35.59,64.77 35.59,66.04 36.23,66.67 | v54.65,56.52 55.88,56.52 | 55.88,56.52 U$21.28 | v54.01,64.14 55.28,65.41 55.28,68.58 54.65,69.22 45.12,69.22 44.48,69.85 U$3.8 44.13,71.53 C3.1 41.09,71.53 36.23,66.67 | 55.88,56.52 55.88,57.97 C12.2 | U$2.1 18.07,39.78 | 18.07,39.78 18.07,42.29 | 18.07,42.29 13.37,46.99 13.37,55.88 21.62,64.14 21.62,64.77 | C7.1 19.09,66.67 C10.+ | C7.1 16.77,65.82 IC2.OUT | U$2.28 23.91,37.43 C6.2 | 18.07,39.78 R2.2 21.84,39.78 22.26,39.37 22.26,38.1 22.68,37.69 C6.2 | C6.2 25,38.52 R3.2 | R5.2 36.23,66.67
  Bottom 0.3: v54.01,64.14 54.01,57.15 v54.65,56.52 54.65,54.61 57.19,52.07 v57.19,48.9 | v60.99,38.73 59.73,37.47 v54.33,37.47
+12V
  Top 0.3: C9.+ 7.24,65.82 C8.1 11.69,66.04 IC2.IN 14.94,66.97 PAD97.1
  Top 0.61: PAD49.P$1 1.94,1.27 4.48,1.27 PAD50.P$1 | PAD51.P$1 7.66,1.27 | PAD52.P$1 10.2,1.27 | PAD53.P$1 13.37,1.27 | PAD54.P$1 15.91,1.27 | PAD55.P$1 19.09,1.27 | PAD56.P$1 21.62,1.27 | PAD57.P$1 24.8,1.27 | PAD58.P$1 27.34,1.27 | PAD59.P$1 30.52,1.27 | PAD60.P$1 33.05,1.27 | PAD61.P$1 36.23,1.27 | PAD62.P$1 38.77,1.27 | PAD63.P$1 41.95,1.27 | PAD64.P$1 44.48,1.27 | PAD65.P$1 47.66,1.27 | PAD66.P$1 50.2,1.27 | PAD67.P$1 53.38,1.27 | PAD68.P$1 55.91,1.27 | PAD69.P$1 59.09,1.27 | PAD70.P$1 61.63,1.27 | PAD71.P$1 64.81,1.27 | PAD72.P$1 67.34,1.27 | PAD73.P$1 70.52,1.27 | PAD74.P$1 73.06,1.27 | PAD75.P$1 76.23,1.27 | PAD76.P$1 78.78,1.27 | PAD77.P$1 81.95,1.27 | PAD78.P$1 84.49,1.27 | PAD79.P$1 87.67,1.27 | PAD80.P$1 90.2,1.27 | PAD81.P$1 94.02,29.84 | PAD82.P$1 94.02,32.38 | PAD83.P$1 94.02,35.56 | PAD84.P$1 94.02,38.1 | PAD85.P$1 94.02,41.27 | PAD86.P$1 94.02,43.81 | PAD87.P$1 94.02,46.99 | PAD88.P$1 94.02,49.53 | PAD89.P$1 94.02,52.7 | PAD90.P$1 94.02,55.24 | PAD91.P$1 94.02,58.42 | PAD92.P$1 94.02,60.96 | PAD93.P$1 94.02,64.14 | PAD94.P$1 94.02,66.67 | PAD95.P$1 94.02,69.85 | PAD96.P$1 94.02,72.39
  Top 1.27: 4.48,1.27 7.66,1.27 10.2,1.27 13.37,1.27 15.91,1.27 19.09,1.27 21.62,1.27 24.8,1.27 27.34,1.27 30.52,1.27 33.05,1.27 36.23,1.27 38.77,1.27 41.95,1.27 44.48,1.27 47.66,1.27 50.2,1.27 53.38,1.27 55.91,1.27 59.09,1.27 61.63,1.27 64.81,1.27 67.34,1.27 70.52,1.27 73.06,1.27 76.23,1.27 78.78,1.27 81.95,1.27 84.49,1.27 87.67,1.27 90.2,1.27 92.11,1.27 94.02,3.17 94.02,29.84 94.02,32.38 94.02,35.56 94.02,38.1 94.02,41.27 94.02,43.81 94.02,46.99 94.02,49.53 94.02,52.7 94.02,55.24 94.02,58.42 94.02,60.96 94.02,64.14 94.02,66.67 94.02,69.85 94.02,72.39 94.02,73.66 89.57,78.11 17.82,78.11 14.94,75.23 PAD97.1
GND  (via drill 0.6, 1.6)
  Top 0.3: U$12.24 U$12.25 64.02,35.3 C11.1 65.66,35.15 v66.08,35.56 | U$12.5 U$12.4 | U$12.4 U$12.3 | U$2.25 U$2.24 U$2.5 U$2.4 U$2.3 U$2.2 16.78,35.33 v15.91,36.2 | U$21.25 U$21.24 58.73,59.09 v58.14,59.69 57.72,60.1 C12.1 | U$21.4 U$21.5 58.73,51.72 59.09,52.07 64.17,52.07 64.58,51.66 U$21.14 65.82,50.42 v66.08,50.16 | IC1.5 38.37,58.66 v39.41,59.69 39.97,59.12 IC1.3 39.97,55.81 38.77,54.61 38.77,52.07 39.17,51.67 IC1.21 39.19,49.03 C2.1 40.04,46.35 v40.67,45.72 | U$2.14 18.07,25.78 v19.09,24.77 | U$12.14 56.17,27.68 v56.55,27.3 | R4.1 v50.84,62.87 | C1.1 38.55,63.28 v40.04,64.77 41.31,63.5 SJ5.2 | C4.2 v25.43,63.5 | C5.2 v22.26,59.69 | SJ8.2 SJ7.2 SJ6.2 18.45,56.01 v18.45,57.78 | SJ4.2 SJ3.2 SJ2.2 | SJ2.2 SJ1.2 | SJ2.2 47.79,41.4 v47.66,41.27 | C7.2 15.69,63.72 IC2.GND | C8.2 6.8,63.72 C9.- | C3.2 40.9,69.44 v40.67,69.22 | U$3.5 50.14,71.18 v50.2,71.12 | C6.1 v24.16,41.27 | U$12.4 54.91,35.3 v54.65,35.56
  Top 0.5: U$1.3 v1.94,21.59 | U$1.1 v4.48,21.59 | v7.66,21.59 U$4.3 7.66,17.78 8.29,17.14 9.56,17.14 10.2,17.78 U$4.1 v10.2,21.59 | U$5.3 v13.37,21.59 | U$5.1 v15.91,21.59 | U$6.3 v19.09,21.59 | U$6.1 v21.62,21.59 | U$7.3 v24.8,21.59 | U$7.1 v27.34,21.59 | U$8.3 v30.52,21.59 | U$8.1 v33.05,21.59 | U$9.3 v36.23,21.59 | U$9.1 v38.77,21.59 | U$10.3 v41.95,21.59 | U$10.1 v44.48,21.59 | U$11.3 v47.66,21.59 | U$11.1 v50.2,21.59 | U$13.3 v53.38,21.59 | U$13.1 v55.91,21.59 | U$14.3 v59.09,21.59 | U$14.1 v61.63,21.59 | U$15.3 64.81,17.78 65.44,17.14 67.34,17.14 | 67.34,17.14 70.52,17.14 | 70.52,17.14 71.79,17.14 73.06,18.41 U$16.1 v73.06,21.59 | U$16.3 70.52,17.14 | U$15.1 67.34,17.14 | U$17.3 v76.23,21.59 | U$17.1 v78.78,21.59 | U$18.3 v81.95,21.59 | U$18.1 v84.49,21.59 | U$19.3 v87.67,21.59 | U$19.1 v90.2,21.59 | U$20.3 v73.69,29.84 | U$20.1 74.33,32.38 v73.69,33.02 | U$22.3 v73.69,35.56 | U$22.1 v73.69,38.1 | U$23.3 v73.69,41.27 | U$23.1 v73.69,43.81 | U$24.3 v73.69,46.99 | U$24.1 v73.69,49.53 | U$25.3 v73.69,52.7 | U$25.1 v73.69,55.24 | U$26.3 v73.69,58.42 | U$26.1 v73.69,60.96 | U$27.3 v73.69,64.14 | U$27.1 v73.69,66.67 | U$28.3 v73.69,69.85 | U$28.1 v73.69,72.39
  Top 1.27: PAD98.1 v9.28,73.66
  Bottom 0.3: 69.89,31.75 72.42,31.75 | 25.75,33.66 28.29,33.97 28.61,33.66 | v15.91,36.2 15.91,36.83 | v19.09,24.77 19.09,24.13 | v56.55,27.3 56.55,26.67 | v66.08,35.56 66.71,35.56 | v58.14,59.69 58.14,59.37 58.45,59.05 | v50.84,62.87 50.84,62.23 | v40.04,64.77 38.13,65.41 | v39.41,59.69 39.41,60.33 | v25.43,63.5 24.8,63.5 | v22.26,59.69 21.62,59.69 | v18.45,57.78 18.45,58.42 | v40.67,45.72 40.67,45.09 | v47.66,41.27 48.3,41.27 | v40.67,69.22 40.04,68.58 | v50.2,71.12 50.84,71.12 | v66.08,50.16 66.71,50.16 | v24.16,41.27 24.16,41.91
  Bottom 0.5: 3.21,17.14 3.21,17.78 | v1.94,21.59 2.58,21.59 | v4.48,21.59 5.12,21.59 | v7.66,21.59 7.66,22.23 | v10.2,21.59 10.2,22.23 | v13.37,21.59 13.37,22.23 | v15.91,21.59 15.91,22.23 | v19.09,21.59 19.09,22.23 | v21.62,21.59 21.62,22.23 | v24.8,21.59 24.8,22.23 | v27.34,21.59 26.7,21.59 | v30.52,21.59 29.88,21.59 | v33.05,21.59 33.69,21.59 | v36.23,21.59 36.23,22.23 | v38.77,21.59 38.77,22.23 | v41.95,21.59 41.95,22.23 | v44.48,21.59 44.48,22.23 | v47.66,21.59 47.66,22.23 | v50.2,21.59 50.2,22.23 | v53.38,21.59 53.38,22.23 | v55.91,21.59 55.91,22.23 | v59.09,21.59 59.09,22.23 | v61.63,21.59 60.99,21.59 | v73.06,21.59 73.06,22.23 | v76.23,21.59 76.23,22.23 | v78.78,21.59 78.78,22.23 | v81.95,21.59 81.95,22.23 | v84.49,21.59 84.49,22.23 | v87.67,21.59 87.67,22.23 | v90.2,21.59 90.2,22.23 | v73.69,29.84 73.06,29.84 | v73.69,33.02 73.06,33.02 | v73.69,35.56 73.06,35.56 | v73.69,38.1 73.06,38.1 | v73.69,41.27 73.06,41.27 | v73.69,43.81 73.06,43.81 | v73.69,46.99 73.06,46.99 | v73.69,49.53 73.06,49.53 | v73.69,52.7 73.06,52.7 | v73.69,55.24 73.06,55.24 | v73.69,58.42 73.06,58.42 | v73.69,60.96 73.06,60.96 | v73.69,64.14 73.06,64.14 | v73.69,66.67 73.06,66.67 | v73.69,69.85 73.06,69.85 | v73.69,72.39 73.06,72.39
  pour Bottom (isolate 0.58): 0,80.01 95,80.01 95,0 0,0
LED_ENABLE  (via drill 0.6)
  Top 0.3: U$12.23 60.66,33.99 57.19,37.47 57.19,41.27 54.65,43.81 v52.1,43.81 | v55.91,47.62 54.65,48.9 54.65,52.7 55.28,53.34 59.09,53.34 59.38,53.63 U$21.23 | IC1.1 41.57,58.68 v42.58,59.69 43.22,60.33 43.22,64.55 R5.1 | v52.1,43.81 52.33,43.59 | U$2.23 46.09,32.73 52.1,38.73 v52.1,43.81
  Bottom 0.3: v55.91,47.62 v52.1,43.81 48.93,46.99 48.93,55.24 44.48,59.69 v42.58,59.69
N$1
  Top 0.3: IC1.30 42.02,54.54 41.31,55.24 41.31,55.88 44.48,59.05 U$3.1
N$2
  Top 0.3: U$3.4 48.3,61.59 45.76,59.05 45.76,57.78 44.48,56.52 44.48,55.88 43.95,55.34 IC1.31
N$3
  Top 0.3: R8.2 LED3.C
N$4
  Top 0.3: U$3.2 U$3.3 47.02,63.09 R4.2 45.76,62.87 45.12,62.23 45.12,58.2 IC1.32
N$5
  Top 0.61: U$1.8 U$1.7 PAD1.P$1
N$6
  Top 0.61: U$1.6 U$1.5 0.67,9.72 PAD2.P$1
N$7  (via drill 0.6)
  Top 0.3: JP1.5 39.19,40.42 R1.1 v41.31,41.91 | v45.76,53.98 45.52,53.74 IC1.29
  Bottom 0.3: v41.31,41.91 45.76,46.35 v45.76,53.98
N$8
  Top 0.3: IC1.15 32.96,51.34 31.15,49.53 31.15,38.1 31.79,37.47 41.31,37.47 JP1.1
N$9
  Top 0.3: JP1.9 32.42,48.48 IC1.16
N$10
  Top 0.3: JP1.7 34.96,48.26 35.75,49.05 IC1.17
N$11
  Top 0.3: U$3.7 PAD99.P$1
N$13
  Top 0.61: U$4.8 U$4.7 PAD3.P$1
N$14
  Top 0.61: PAD4.P$1 U$4.5 U$4.6
N$15
  Top 0.3: R7.2 LED2.C
N$16  (via drill 0.6)
  Top 0.3: U$4.4 6.38,24.77 8.29,26.67 v9.56,26.67 | v9.56,29.84 10.83,31.11 12.1,31.11 13.09,30.12 U$2.10
  Bottom 0.3: v9.56,26.67 v9.56,29.84
N$17
  Top 0.61: U$5.8 U$5.7 PAD5.P$1
N$18
  Top 0.61: U$5.6 U$5.5 PAD6.P$1
N$19  (via drill 0.6)
  Top 0.3: U$5.2 14.64,26.04 v15.28,26.67 | U$2.9 15.62,30.77 v15.28,31.11
  Bottom 0.3: v15.28,26.67 v15.28,31.11
N$20  (via drill 0.6)
  Top 0.3: U$5.4 12.1,25.4 v13.37,26.67 | v13.37,31.75 14.01,32.38 15.91,32.38 16.87,31.43 U$2.8
  Bottom 0.3: v13.37,26.67 v13.37,31.75
N$21
  Top 0.61: U$6.8 U$6.7 PAD7.P$1
N$22
  Top 0.61: U$6.6 U$6.5 PAD8.P$1
N$23
  Top 0.3: U$6.2 20.36,31.11 19.39,32.08 U$2.7
N$24  (via drill 0.6)
  Top 0.3: U$6.4 17.82,24.13 v16.55,25.4 | v15.91,33.66 16.84,32.73 U$2.6
  Bottom 0.3: v16.55,25.4 16.55,33.02 v15.91,33.66
N$25
  Top 0.61: U$7.8 U$7.7 PAD9.P$1
N$26
  Top 0.61: U$7.6 U$7.5 PAD10.P$1
N$27
  Top 0.3: R6.2 LED1.C
N$28
  Top 0.3: IC1.12 25.42,53.74 R6.1
N$29
  Top 0.61: U$8.8 U$8.7 PAD11.P$1
N$30
  Top 0.61: U$8.6 U$8.5 PAD12.P$1
N$31
  Top 0.3: IC1.13 27.8,52.94 R7.1
N$32
  Top 0.3: IC1.14 30.17,52.14 R8.1
N$33
  Top 0.61: U$9.8 U$9.7 PAD13.P$1
N$34
  Top 0.61: U$9.6 U$9.5 PAD14.P$1
N$35
  Top 0.3: SJ4.1 45.72,51.34 IC1.26
N$36
  Top 0.3: SJ3.1 43.98,50.54 IC1.25
N$37
  Top 0.61: U$10.8 U$10.7 PAD15.P$1
N$38
  Top 0.61: U$10.6 U$10.5 PAD16.P$1
N$39
  Top 0.3: SJ2.1 42.94,49.05 IC1.24
N$40
  Top 0.3: SJ1.1 45.76,43.18 40.77,48.16 IC1.23
N$41
  Top 0.3: IC1.7 36.77,59.15 33.89,62.03 Q1.1 31.65,63.5 C4.1
N$42
  Top 0.3: IC1.8 34.98,58.62 Q1.2 28.64,59.69 C5.1
N$43
  Top 0.3: IC1.2 40.77,59.15 41.31,59.69 SJ5.1
N$44
  Top 0.3: IC1.9 20.11,56.14 SJ6.1
N$45
  Top 0.3: IC1.10 21.85,55.34 SJ7.1
N$46
  Top 0.3: IC1.11 23.59,54.54 SJ8.1
N$47
  Top 0.3: U$3.6 47.02,72.39 47.66,73.03 PAD100.P$1
N$48
  Top 0.61: U$11.8 U$11.7 PAD17.P$1
N$49
  Top 0.61: U$11.6 U$11.5 PAD18.P$1
N$50
  Top 0.3: U$1.2 3.21,22.86 8.53,28.18 U$2.13
N$51
  Top 0.3: U$2.12 5.37,28.82 0.67,24.13 U$1.4
N$52  (via drill 0.6)
  Top 0.3: U$4.2 8.93,24.13 v11.46,26.67 | U$2.11 11.84,29.48 v11.46,29.84
  Bottom 0.3: v11.46,26.67 v11.46,29.84
N$53
  Top 0.3: U$7.2 26.07,24.77 23.91,26.93 U$2.15
N$54
  Top 0.3: U$7.4 23.53,25.4 22.26,26.67 22.26,27.3 23.13,28.18 U$2.16
N$55  (via drill 0.6)
  Top 0.3: U$2.17 24.55,28.82 27.98,25.4 v27.98,23.5 | v31.79,22.86 U$8.2
  Bottom 0.3: v31.79,22.86 28.61,22.86 v27.98,23.5
N$56
  Top 0.3: U$2.18 25.17,29.48 29.25,25.4 U$8.4
N$57  (via drill 0.6)
  Top 0.3: U$2.19 25.79,30.12 v31.15,24.77 | v36.23,24.77 37.5,23.5 U$9.2
  Bottom 0.3: v31.15,24.77 v36.23,24.77
N$58
  Top 0.3: U$2.20 27.05,30.77 34.96,22.86 U$9.4
N$59  (via drill 0.6)
  Top 0.3: U$2.21 30.2,31.43 v34.33,27.3 | v38.77,27.3 43.22,22.86 U$10.2
  Bottom 0.3: v34.33,27.3 v38.77,27.3
N$60
  Top 0.3: U$2.22 31.46,32.08 40.67,22.86 U$10.4
N$61
  Top 0.61: U$13.8 U$13.7 PAD19.P$1
N$63
  Top 0.61: U$13.6 U$13.5 PAD20.P$1
N$64  (via drill 0.6)
  Top 0.3: U$13.4 52.1,26.67 v50.84,27.94 | v50.84,32.7 53.06,32.7 54.37,31.39 U$12.10
  Bottom 0.3: v50.84,27.94 v50.84,32.7
N$65
  Top 0.61: U$14.8 U$14.7 PAD21.P$1
N$66
  Top 0.61: U$14.6 U$14.5 PAD22.P$1
N$67
  Top 0.3: U$14.2 60.36,24.13 57.82,26.67 57.82,31.11 56.89,32.05 U$12.9
N$68  (via drill 0.6)
  Top 0.3: v54.65,33.02 54.97,32.7 U$12.8 | v54.65,27.94 54.65,27.3 57.82,24.13 U$14.4
  Bottom 0.3: v54.65,27.94 v54.65,33.02
N$69
  Top 0.61: U$15.8 U$15.7 PAD23.P$1
N$70
  Top 0.61: U$15.6 U$15.5 PAD24.P$1
N$71  (via drill 0.6)
  Top 0.3: U$15.2 66.02,19.75 66.02,21.02 v64.81,22.23 | U$12.7 56.86,33.34 58.45,31.75 58.45,27.3 61.63,24.13 v61.63,23.5
  Bottom 0.3: v64.81,22.23 63.53,23.5 v61.63,23.5
N$72
  Top 0.3: U$15.4 63.53,24.13 59.73,27.94 59.73,31.75 57.48,33.99 U$12.6
N$73
  Top 0.61: U$16.8 U$16.7 PAD25.P$1
N$74
  Top 0.61: U$16.6 U$16.5 PAD26.P$1
N$75
  Top 0.61: U$17.8 U$17.7 PAD27.P$1
N$76
  Top 0.61: U$17.6 U$17.5 PAD28.P$1
N$77
  Top 0.61: U$18.8 U$18.7 PAD29.P$1
N$78
  Top 0.61: U$18.6 U$18.5 PAD30.P$1
N$79
  Top 0.61: U$19.8 U$19.7 PAD31.P$1
N$80
  Top 0.61: U$19.6 U$19.5 PAD32.P$1
N$81
  Top 0.3: U$11.2 48.93,27.94 50.44,29.45 U$12.13
N$82
  Top 0.3: U$11.4 46.39,27.94 48.55,30.09 U$12.12
N$83  (via drill 0.6)
  Top 0.3: U$13.2 54.65,26.04 v52.74,27.94 | v52.74,31.43 53.43,30.75 U$12.11
  Bottom 0.3: v52.74,27.94 v52.74,31.43
N$84
  Top 0.3: U$16.2 71.79,21.59 71.16,22.23 67.98,22.23 62.01,28.2 U$12.15
N$85
  Top 0.3: U$16.4 69.25,20.95 68.61,21.59 67.34,21.59 60.36,28.57 60.36,29.21 60.59,29.45 U$12.16
N$86
  Top 0.3: U$17.2 77.5,22.86 75.6,24.77 66.71,24.77 63.22,28.26 63.22,29.53 62.65,30.09 U$12.17
N$87  (via drill 0.6)
  Top 0.3: U$17.4 74.97,21.59 73.06,23.5 v68.61,23.5 | v67.98,26.04 66.39,27.62 64.81,27.62 63.85,28.57 63.85,29.84 62.95,30.75 U$12.18
  Bottom 0.3: v68.61,23.5 68.61,25.4 v67.98,26.04
N$88
  Top 0.3: U$18.2 83.22,22.86 80.05,26.04 71.16,26.04 67.34,29.84 66.08,29.84 65.76,30.16 64.81,30.16 63.57,31.39 U$12.19
N$89  (via drill 0.6)
  Top 0.3: U$18.4 80.68,23.5 78.78,25.4 70.52,25.4 67.03,28.89 v65.12,28.89 | U$12.20 64.51,32.05 v65.12,31.43
  Bottom 0.3: v65.12,28.89 v65.12,31.43
N$90
  Top 0.3: U$12.21 67.03,32.7 72.42,27.3 83.86,27.3 88.94,22.23 U$19.2
N$91  (via drill 0.6)
  Top 0.3: U$19.4 86.39,22.86 82.58,26.67 71.79,26.67 67.34,31.11 v66.71,31.11 | U$12.22 66.08,33.34 v66.71,33.97
  Bottom 0.3: v66.71,31.11 v66.71,33.97
N$98
  Top 0.61: U$20.8 U$20.7 PAD33.P$1
N$99
  Top 0.61: U$20.6 U$20.5 PAD34.P$1
N$100
  Top 0.61: U$22.8 U$22.7 PAD35.P$1
N$101
  Top 0.61: U$22.6 U$22.5 PAD36.P$1
N$102  (via drill 0.6)
  Top 0.3: U$21.10 61.98,46.63 65.44,43.18 65.44,38.1 v66.39,37.15 | U$22.4 72.74,34.29 70.2,36.83 v69.89,36.83
  Bottom 0.3: v66.39,37.15 69.57,37.15 v69.89,36.83
N$103
  Top 0.61: U$23.8 U$23.7 PAD37.P$1
N$104
  Top 0.61: U$23.6 U$23.5 PAD38.P$1
N$105  (via drill 0.6)
  Top 0.3: U$23.2 v69.89,42.55 | v62.9,42.55 62.9,44.45 61.34,46.02 U$21.9
  Bottom 0.3: v69.89,42.55 v62.9,42.55
N$106  (via drill 0.6)
  Top 0.3: U$23.4 70.52,40.01 v69.89,40.64 | v62.9,40.64 61.63,41.91 61.63,44.45 60.69,45.4 U$21.8
  Bottom 0.3: v69.89,40.64 v62.9,40.64
N$107
  Top 0.61: U$24.8 U$24.7 PAD39.P$1
N$108
  Top 0.61: U$24.6 80.68,46.93 80.68,45.72 U$24.5 PAD40.P$1
N$109  (via drill 0.6)
  Top 0.3: U$21.7 60.03,47.62 v59.41,46.99 | U$24.2 68.61,48.26 v67.34,46.99
  Bottom 0.3: v67.34,46.99 v59.41,46.99
N$110  (via drill 0.6)
  Top 0.3: U$24.4 v68.61,45.72 | U$21.6 59.38,49.19 58.14,47.94 58.14,46.35 v59.41,45.09
  Bottom 0.3: v68.61,45.72 60.04,45.72 v59.41,45.09
N$111
  Top 0.61: U$25.8 U$25.7 PAD41.P$1
N$112
  Top 0.61: U$25.6 U$25.5 PAD42.P$1
N$113
  Top 0.61: U$26.8 U$26.7 PAD43.P$1
N$114
  Top 0.61: U$26.6 U$26.5 PAD44.P$1
N$115
  Top 0.61: U$27.8 U$27.7 PAD45.P$1
N$116
  Top 0.61: U$27.6 U$27.5 PAD46.P$1
N$117
  Top 0.61: U$28.8 U$28.7 PAD47.P$1
N$118
  Top 0.61: U$28.6 U$28.5 PAD48.P$1
N$119
  Top 0.3: U$21.13 63.94,48.49 68.61,43.81 68.61,36.2 73.69,31.11 U$20.2
N$120
  Top 0.3: U$21.12 63.28,47.88 67.98,43.18 67.98,35.56 71.16,32.38 71.16,29.84 72.42,28.57 U$20.4
N$121  (via drill 0.6)
  Top 0.3: U$22.2 71.79,36.83 v69.89,38.73 | v66.71,38.73 66.71,43.18 62.63,47.26 U$21.11
  Bottom 0.3: v69.89,38.73 v66.71,38.73
N$122
  Top 0.3: U$25.2 65.44,53.98 64.58,54.83 U$21.15
N$123
  Top 0.3: U$25.4 66.71,51.44 63.94,54.21 U$21.16
N$124
  Top 0.3: U$26.2 66.08,59.69 63.28,56.9 U$21.17
N$125  (via drill 0.6)
  Top 0.3: U$26.4 71.79,57.15 v70.52,58.42 | v70.52,60.96 66.08,60.96 62.63,57.52 U$21.18
  Bottom 0.3: v70.52,58.42 v70.52,60.96
N$126
  Top 0.3: U$21.19 61.98,58.77 68.61,65.41 U$27.2
N$127  (via drill 0.6)
  Top 0.3: U$27.4 v67.66,62.87 | v64.17,62.87 61.34,60.03 U$21.20
  Bottom 0.3: v67.66,62.87 v64.17,62.87
N$128
  Top 0.3: U$21.21 60.69,61.28 70.52,71.12 U$28.2
N$129  (via drill 0.6)
  Top 0.3: U$28.4 v69.89,68.58 | v65.44,68.58 60.03,63.17 U$21.22
  Bottom 0.3: v69.89,68.58 v65.44,68.58
SCL
  Top 0.3: U$12.26 59.98,35.95 58.45,37.47 58.45,41.27 52.1,47.62 52.1,50.8 51.47,51.44 | IC1.28 48.53,52.94 48.93,53.34 50.84,53.34 | 51.47,51.44 50.84,50.8 50.84,38.73 45.76,33.66 27.98,33.66 26.95,34.67 U$2.26 21.24,34.67 20.36,35.56 R2.1 | 51.47,51.44 51.47,52.7 50.84,53.34 | 50.84,53.34 52.1,53.34 53.38,54.61 53.38,57.78 54.65,59.05 57.19,59.05 57.44,58.8 U$21.26
SDA  (via drill 0.6)
  Top 0.3: U$12.27 60.59,36.59 59.09,38.1 59.09,41.91 52.74,48.26 v52.74,52.07 52.74,52.7 54.01,53.98 55.91,53.98 56.78,54.84 U$21.27 | IC1.27 43.13,52.07 v50.2,52.07 50.2,39.37 45.12,34.29 28.61,34.29 27.57,35.33 26.7,35.33 | 26.7,35.33 U$2.27 | R3.1 26.7,35.33
  Bottom 0.3: v50.2,52.07 v52.74,52.07